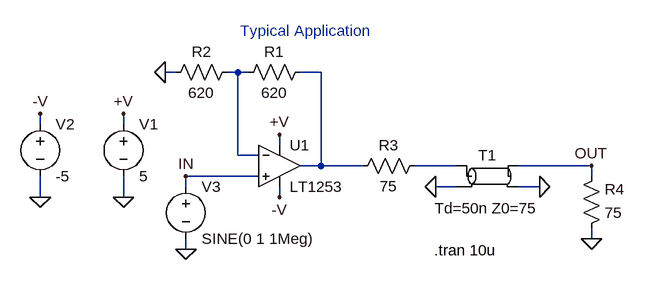
[diagram p0: schematic 1253.asc]
1253.asc, the LTspice schematic file:
Version 4
SHEET 1 896 680
WIRE 32 96 16 96
WIRE 128 96 112 96
WIRE 144 96 128 96
WIRE 256 96 224 96
WIRE -176 176 -176 160
WIRE -48 176 -48 160
WIRE 192 208 192 192
WIRE 128 224 128 96
WIRE 160 224 128 224
WIRE 256 240 256 96
WIRE 256 240 224 240
WIRE 320 240 256 240
WIRE 464 240 400 240
WIRE 672 240 560 240
WIRE 160 256 48 256
WIRE 672 256 672 240
WIRE 48 272 48 256
WIRE 464 272 432 272
WIRE 592 272 560 272
WIRE -176 288 -176 256
WIRE -48 288 -48 256
WIRE 192 288 192 272
WIRE 672 352 672 336
WIRE 48 368 48 352
FLAG -48 288 0
FLAG 192 192 +V
FLAG -48 160 +V
FLAG 192 288 -V
FLAG -176 288 0
FLAG -176 160 -V
FLAG 16 96 0
FLAG 48 368 0
FLAG 672 352 0
FLAG 592 272 0
FLAG 432 272 0
FLAG 48 256 IN
FLAG 672 240 OUT
SYMBOL voltage -48 160 R0
SYMATTR InstName V1
SYMATTR Value 5
SYMBOL voltage -176 160 R0
SYMATTR InstName V2
SYMATTR Value -5
SYMBOL res 240 80 R90
WINDOW 0 0 56 VBottom 0
WINDOW 3 32 56 VTop 0
SYMATTR InstName R1
SYMATTR Value 620
SYMBOL res 128 80 R90
WINDOW 0 0 56 VBottom 0
WINDOW 3 32 56 VTop 0
SYMATTR InstName R2
SYMATTR Value 620
SYMBOL voltage 48 256 R0
SYMATTR InstName V3
SYMATTR Value SINE(0 1 1Meg)
SYMBOL opamps\\LT1253 192 176 R0
SYMATTR InstName U1
SYMBOL res 416 224 R90
WINDOW 0 0 56 VBottom 0
WINDOW 3 32 56 VTop 0
SYMATTR InstName R3
SYMATTR Value 75
SYMBOL res 656 352 M180
WINDOW 0 36 76 Left 0
WINDOW 3 36 40 Left 0
SYMATTR InstName R4
SYMATTR Value 75
SYMBOL tline 512 256 R0
WINDOW 3 -81 49 Left 0
SYMATTR InstName T1
SYMATTR Value Td=50n Z0=75
TEXT 430 370 Left 0 !.tran 10u
TEXT 232 48 Bottom 0 ;Typical Application

The netlist it stands for:
* 1253.asc
V1 +V 0 5
V2 -V 0 -5
R1 N002 N001 620
R2 N001 0 620
V3 IN 0 SINE(0 1 1Meg)
XU1 IN N001 +V -V N002 LT1253  ; pins In+ In- V+ V- OUT
R3 N003 N002 75
R4 0 OUT 75
T1 N003 0 OUT 0 Td=50n Z0=75
.tran 10u
* Typical Application
.backanno
.end